# EAGLE design MainBoard (EAGLE 9.6.2)
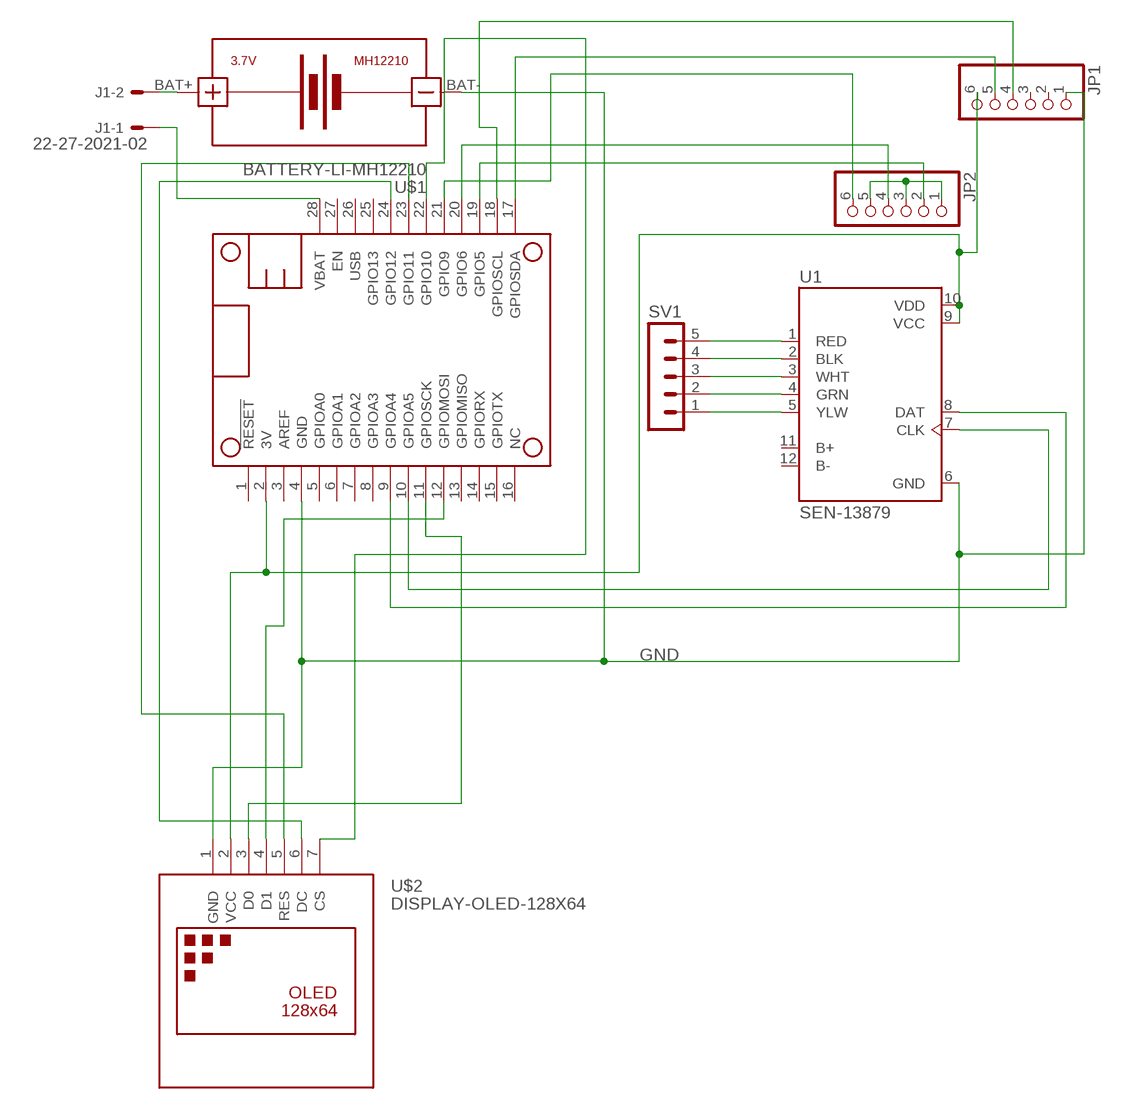
[diagram p0: schematic, sheet 1]

## Parts
J1  22-27-2021-02  [6410-02]
JP1  PINHD-1X6  [1X06]
JP2  PINHD-1X6  [1X06]
MS1  FEATHERWING_NODIM  [FEATHERWING_DIM]
SV1  MA05-1  [MA05-1]
U1  SEN-13879  [SPARKFUN_SEN-13879]
U$1  BATTERY-LI-MH12210  [BATTERY-LI-MH12210]
U$2  DISPLAY-OLED-128X64  [DISPLAY-OLED-128X64]

## Nets
3V: JP1.6 MS1.2(3V) U1.9(VCC) U1.10(VDD) U$2.2(VCC)
GND: JP1.1 MS1.4(GND) U1.6(GND) U$1.BAT- U$2.1(GND)
N$1: JP2.2 MS1.19(GPIO5)
N$2: MS1.9(GPIOA4) U1.8(DAT)
N$3: MS1.10(GPIOA5) U1.7(CLK)
N$4: J1.2 U$1.BAT+
N$5: SV1.1 U1.5(YLW)
N$6: SV1.2 U1.4(GRN)
N$7: SV1.3 U1.3(WHT)
N$8: JP2.4 MS1.20(GPIO6)
N$9: JP2.6 MS1.21(GPIO9)
N$10: MS1.22(GPIO10) U$2.7(CS)
N$11: MS1.11(GPIOSCK) U$2.3(D0)
N$12: MS1.12(GPIOMOSI) U$2.4(D1)
N$13: MS1.23(GPIO11) U$2.5(RES)
N$14: MS1.24(GPIO12) U$2.6(DC)
N$15: SV1.4 U1.2(BLK)
N$16: SV1.5 U1.1(RED)
N$21: JP1.4 MS1.18(GPIOSCL)
N$23: JP2.1 JP2.3 JP2.5
SDA: JP1.5 MS1.17(GPIOSDA)
VBAT: J1.1 MS1.28(VBAT)
Unconnected: JP1.2 JP1.3 MS1.1(!RESET) MS1.3(AREF) MS1.5(GPIOA0) MS1.6(GPIOA1) MS1.7(GPIOA2) MS1.8(GPIOA3) MS1.13(GPIOMISO) MS1.14(GPIORX) MS1.15(GPIOTX) MS1.16(NC) MS1.25(GPIO13) MS1.26(USB) MS1.27(EN) U1.11(B+) U1.12(B-)

## Library data of the parts
J1 = con-molex:22-?-02: CONNECTOR wire to board 2.54 mm (.1 inch) pitch header; MF: MOLEX; OC_FARNELL: unknown; OC_NEWARK: unknown
JP1 JP2 = adafruit:PINHD-1X6: PIN HEADER
MS1 = adafruit:FEATHERWING
SV1 = con-lstb:MA05-1: PIN HEADER; OC_FARNELL: unknown; OC_NEWARK: unknown
U1 = SEN-13879:SEN-13879: Load Cell Amp Hx711; AVAILABILITY: Unavailable; DESCRIPTION: External Input Sensor Amplifier; MF: SparkFun; MP: SEN-13879; PACKAGE: None; PRICE: None
U$1 = diy-modules:BATTERY-LI-MH12210: Lithium-Ion MH12210 Rechargeable Battery Panasonic NCR18650PF battery datasheet available here: https://industrial.panasonic.com/cdbs/www-data/pdf2/ACI4000/ACI4000C12.pdf Click here to find device on ebay.com <http://www.ebay.com/sch/ncr18650b+battery>
U$2 = diy-modules:DISPLAY-OLED-128X64: 128x64 Dot Matrix OLED Module based on SSD1306 chip Variant with SPI interface More details available here: http://www.instructables.com/id/How-to-use-OLED-display-arduino-module/ SSD1306 datasheet: https://cdn-shop.adafruit.com/datasheets/SSD1306.pdf Click here to find device on ebay.com <http://www.ebay.com/sch/oled+display+128x64> Note: There are two variants: I2C and SPI. Search for the proper version.

## Board
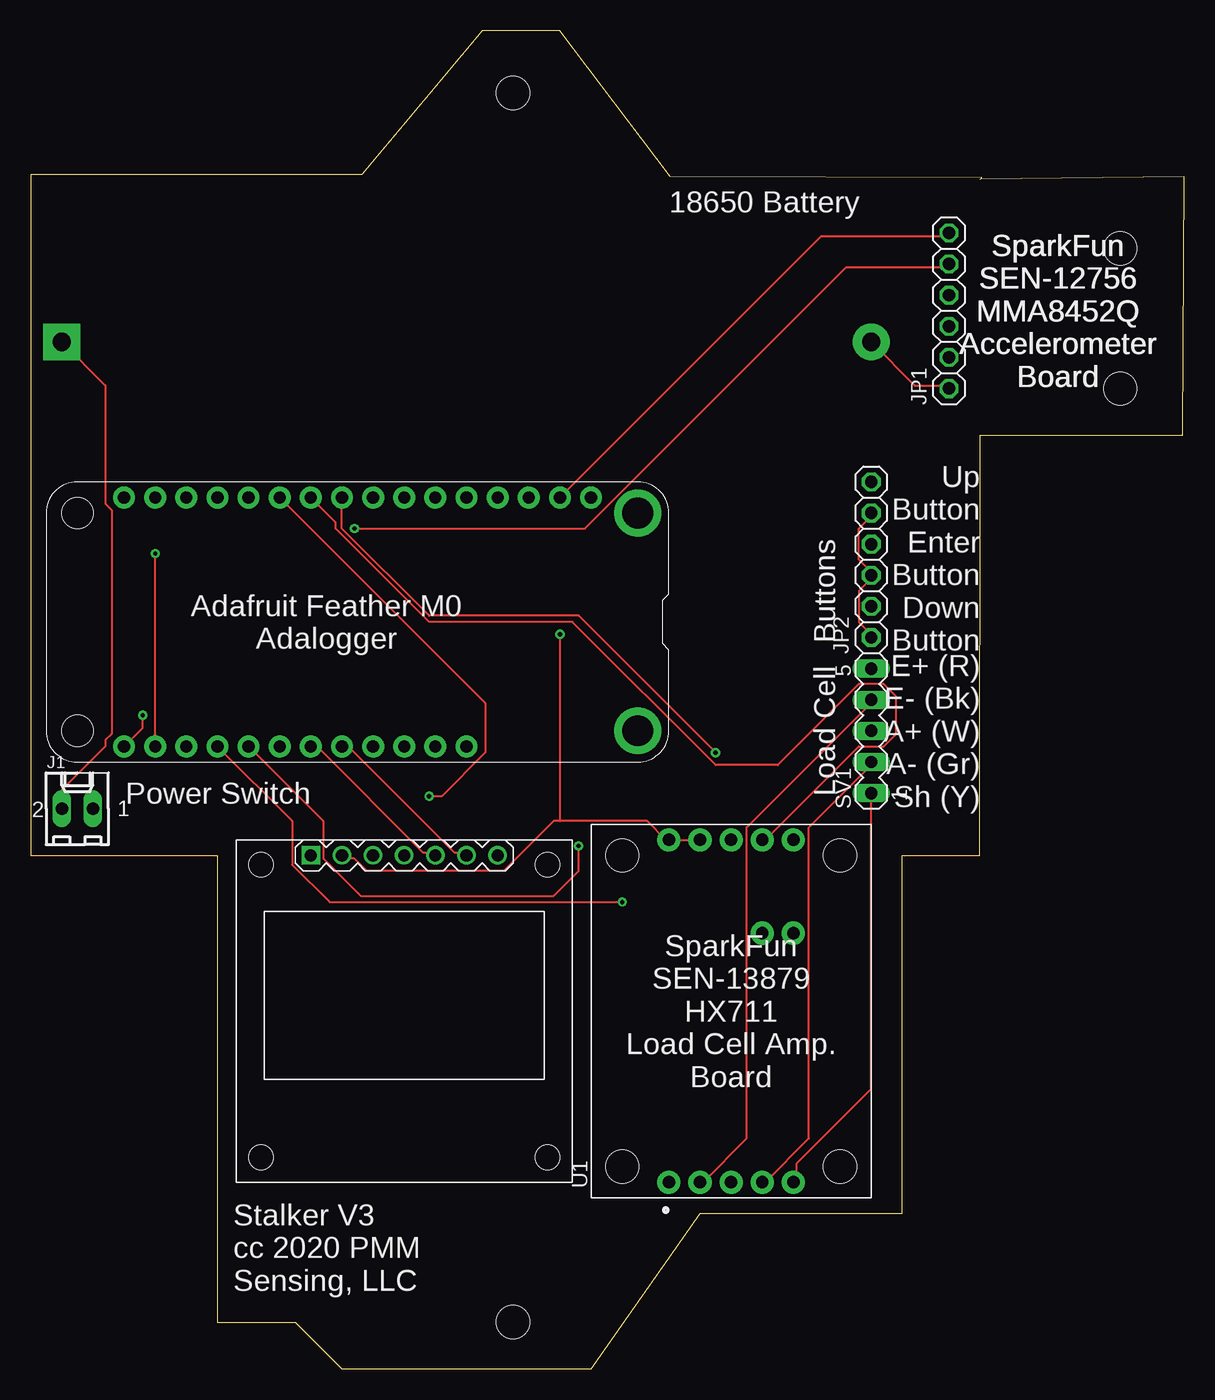
[diagram p1: board, top side]
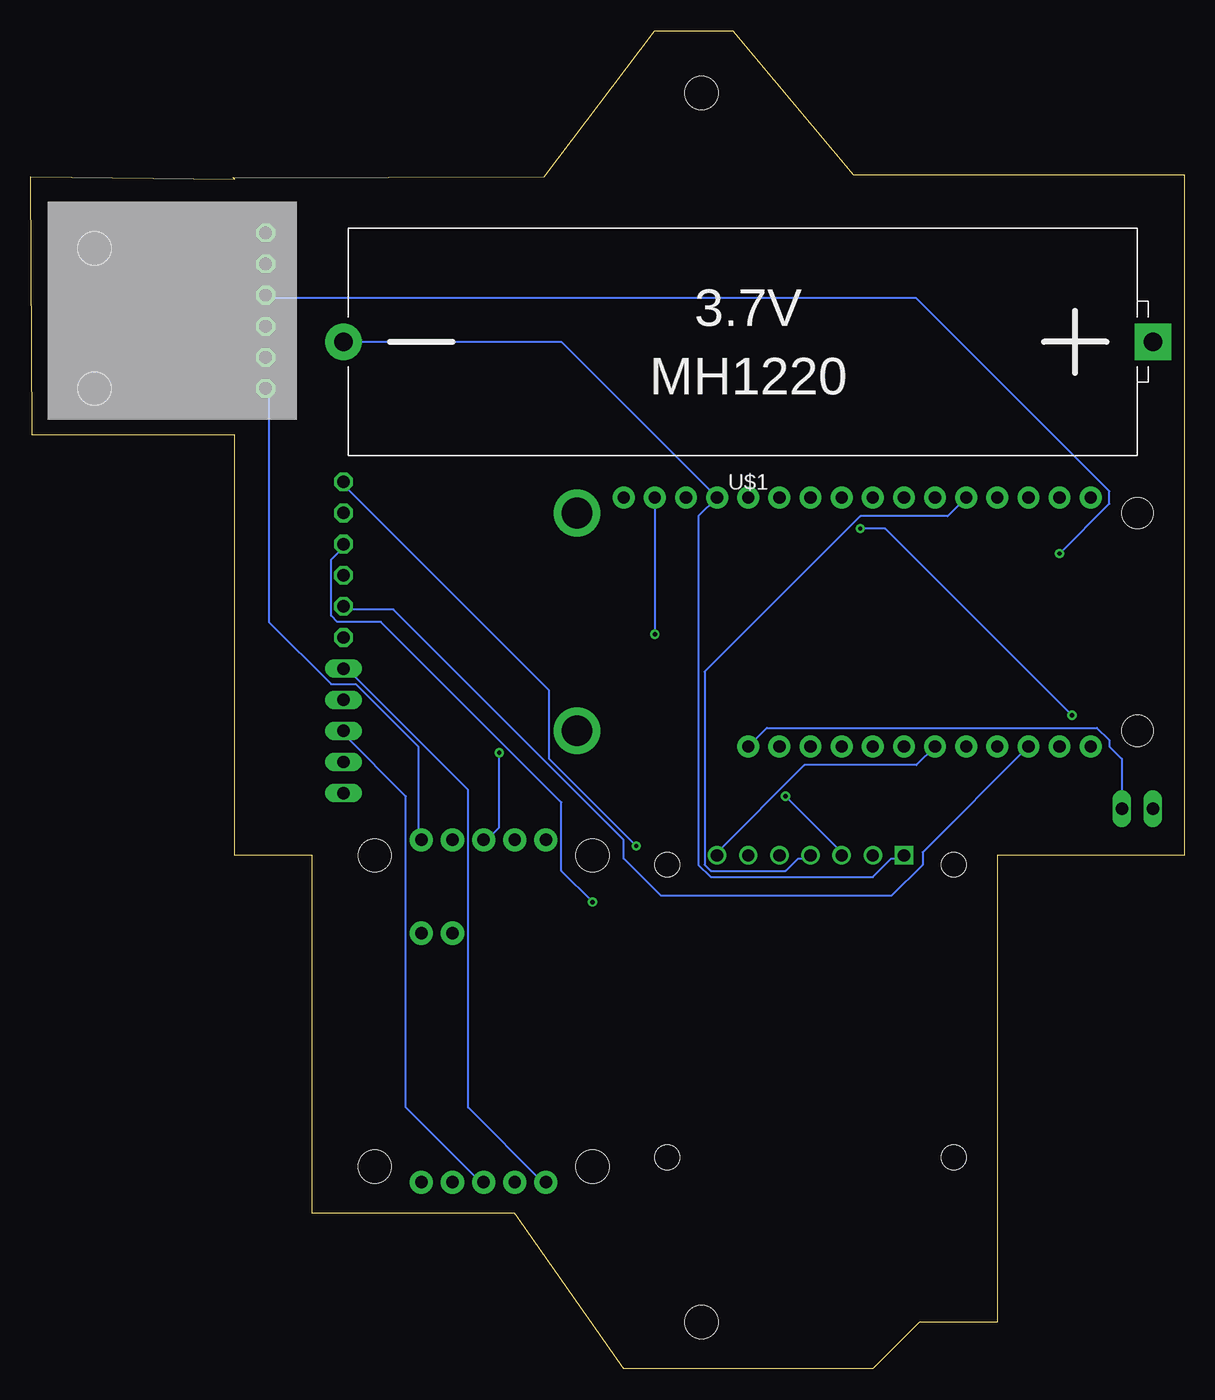
[diagram p2: board, bottom side, seen from below]

Size 94.11 x 109.22 mm. Coordinates in mm from the lower left corner, seen from the top.
Outline: 0,41.91 15.24,41.91 15.24,3.81 21.59,3.81 25.4,0 45.72,0 54.61,12.7 71.12,12.7 71.12,41.91 77.45,41.91 77.47,76.2 93.98,76.2 94.11,97.28 77.47,97.1 77.58,97.21 52.2,97.28 43.18,109.22 36.83,109.22 27,97.46 0,97.46 0,41.91
Copper layers (1*16): Top 0.035mm / dielectric 0.15mm / Bottom 0.035mm
Design rules "default": minimum track width 6mil, minimum drill 0.35mm, track to track 6mil, track to pad 6mil, pad to pad 6mil, via to via 6mil, smd to smd 6mil, copper to edge 40mil, drill to drill 6mil, minimum pad ring 10mil, minimum via ring 8mil, stop-mask expansion 4mil, vias tented up to drill 0mil, thermal gap 10mil
Holes 2.71 mm at 39.37,104.14 39.37,3.81
Holes 2.69 mm at 48.26,41.91 48.26,16.51 66.04,16.51 66.04,41.91 88.9,91.44 88.9,80.01

### Footprints (pad centres in the part's own frame; a part is rotated, then mirrored left to right if it is on the bottom)
6410-02 = drill 1.016 long: 1 1.27,0; 2 -1.27,0
1X06 = drill 1.016 octagon: 1 -6.35,0; 2 -3.81,0; 3 -1.27,0; 4 1.27,0; 5 3.81,0; 6 6.35,0
FEATHERWING_DIM = drill 1 pad 1.778: 1 6.35,1.27; 2 8.89,1.27; 3 11.43,1.27; 4 13.97,1.27; 5 16.51,1.27; 6 19.05,1.27; 7 21.59,1.27; 8 24.13,1.27; 9 26.67,1.27; 10 29.21,1.27; 11 31.75,1.27; 12 34.29,1.27; 13 36.83,1.27; 14 39.37,1.27; 15 41.91,1.27; 16 44.45,1.27; 17 44.45,21.59; 18 41.91,21.59; 19 39.37,21.59; 20 36.83,21.59; 21 34.29,21.59; 22 31.75,21.59; 23 29.21,21.59; 24 26.67,21.59; 25 24.13,21.59; 26 21.59,21.59; 27 19.05,21.59; 28 16.51,21.59 | drill 2.5 pad 3.81: P$1 2.54,20.32; P$2 2.54,2.54 | hole 2.54: 48.26,20.32; 48.26,2.54
MA05-1 = drill 1.016 long: 1 -5.08,0; 2 -2.54,0; 3 0,0; 4 2.54,0; 5 5.08,0
SPARKFUN_SEN-13879 = drill 1.016 pad 1.88: 1 -13.97,5.08; 2 -13.97,2.54; 3 -13.97,0; 4 -13.97,-2.54; 5 -13.97,-5.08; 6 13.97,-5.08; 7 13.97,-2.54; 8 13.97,0; 9 13.97,2.54; 10 13.97,5.08; 11 6.35,-2.54; 12 6.35,-5.08
BATTERY-LI-MH12210 = drill 1.5 pad 3 square: BAT+ -33.02,0 | drill 1.5 pad 3: BAT- 33.02,0
DISPLAY-OLED-128X64 = drill 1 square: 1 -7.62,12.7 | drill 1: 2 -5.08,12.7; 3 -2.54,12.7; 4 0,12.7; 5 2.54,12.7; 6 5.08,12.7; 7 7.62,12.7 | hole 2: -11.684,11.938; 11.684,11.938; 11.684,-11.938; -11.684,-11.938

### Placement (x,y rotation side)
J1  3.81,45.72 0 top
JP1  74.93,86.36 90 top
JP2  68.58,66.04 90 top
MS1  52.07,72.39 180 top
SV1  68.58,52.07 90 top
U1  57.15,29.21 90 top
U$1  35.56,83.82 180 bottom
U$2  30.48,29.21 0 top

### Tracks (layer width: path | path; a pad name or v marks a point on that pad's centre or on a via)
3V  (via drill 0.35)
  Top 0.152: 43.18,44.7 50.29,44.7 51.82,43.18 U1.10 U1.9 | 43.18,44.7 42.67,44.7 38.61,40.64 27.43,40.64 26.42,41.66 25.4,41.66 U$2.2 | MS1.2 64.52,92.46 74.68,92.46 JP1.6 | v43.18,59.94 43.18,44.7
  Bottom 0.152: MS1.2 v43.18,59.94
GND
  Top 0.152: U$1.BAT- 72.14,80.26 74.68,80.26 JP1.1
  Bottom 0.152: U$2.1 22.86,41.66 23.88,41.66 25.4,40.13 38.61,40.13 39.62,41.15 39.62,69.6 MS1.4 50.8,83.82 U$1.BAT- | U1.6 62.48,43.18 62.48,50.8 67.56,55.88 69.6,55.88 74.68,60.96 74.68,79.76 JP1.1
N$1
  Bottom 0.152: MS1.19 21.34,42.16 21.34,41.15 23.88,38.61 42.67,38.61 45.72,41.66 45.72,43.18 64.52,61.98 68.58,61.98 JP2.2
N$2  (via drill 0.35)
  Top 0.152: MS1.9 25.4,68.58 32.51,61.47 44.7,61.47 v55.88,50.29
  Bottom 0.152: v55.88,50.29 55.88,44.2 56.9,43.18 U1.8
N$3
  Top 0.152: MS1.10 24.89,69.09 24.89,68.58 32.51,60.96 44.2,60.96 55.88,49.28 60.96,49.28 67.56,55.88 69.6,55.88 70.61,54.86 70.61,51.82 69.6,50.8 67.56,50.8 59.94,43.18 U1.7
N$4
  Top 0.152: J1.2 2.54,47.24 6.1,50.8 6.1,51.31 6.6,51.82 6.6,70.1 6.1,70.61 6.1,80.26 U$1.BAT+
N$5
  Top 0.152: SV1.1 68.58,22.86 62.48,16.76 62.48,15.24 U1.5
N$6
  Top 0.152: SV1.2 68.58,49.28 63.5,44.2 63.5,18.8 59.94,15.24 U1.4
N$7
  Bottom 0.152: SV1.3 68.58,51.82 63.5,46.74 63.5,21.34 57.4,15.24 U1.3
N$8  (via drill 0.35)
  Top 0.152: v48.26,38.1 24.38,38.1 21.34,41.15 21.34,44.7 MS1.20
  Bottom 0.152: v48.26,38.1 50.8,40.64 50.8,46.23 65.53,60.96 69.09,60.96 69.6,61.47 69.6,66.04 68.58,67.06 JP2.4
N$9  (via drill 0.35)
  Top 0.152: v44.7,42.67 44.7,40.64 42.67,38.61 26.92,38.61 23.88,41.66 23.88,44.7 MS1.21
  Bottom 0.152: v44.7,42.67 51.82,49.78 51.82,55.37 68.58,72.14 JP2.6
N$10
  Bottom 0.152: MS1.22 21.84,49.28 30.99,49.28 38.1,42.16 U$2.7
N$11  (via drill 0.35)
  Top 0.152: v32.51,46.74 33.53,46.74 37.08,50.29 37.08,54.36 MS1.11
  Bottom 0.152: v32.51,46.74 27.94,42.16 U$2.3
N$12
  Bottom 0.152: MS1.12 19.3,69.6 26.42,69.6 39.12,56.9 39.12,41.15 38.61,40.64 32.51,40.64 31.5,41.66 30.48,41.66 U$2.4
N$13
  Top 0.152: MS1.23 23.37,50.8 32,42.16 33.02,42.16 U$2.5
N$14
  Top 0.152: MS1.24 25.91,50.8 34.54,42.16 35.56,42.16 U$2.6
N$15
  Top 0.152: SV1.4 68.58,54.36 58.42,44.2 58.42,18.8 54.86,15.24 U1.2
N$16
  Bottom 0.152: SV1.5 68.58,56.9 68.07,56.9 58.42,47.24 58.42,21.34 52.32,15.24 U1.1
N$21  (via drill 0.35)
  Top 0.152: MS1.18 v10.16,66.55
  Bottom 0.152: v10.16,66.55 6.1,70.61 6.1,71.63 21.84,87.38 74.68,87.38 JP1.4
N$23
  Top 0.152: JP2.1 68.58,59.94 67.56,60.96 67.56,63.5 68.58,64.52 JP2.3 68.58,65.02 67.56,66.04 67.56,68.58 68.58,69.6 JP2.5
SDA  (via drill 0.35)
  Top 0.152: v26.42,68.58 45.21,68.58 66.55,89.92 74.68,89.92 JP1.5 | v9.14,53.34 9.14,52.32 MS1.17
  Bottom 0.152: v26.42,68.58 24.38,68.58 v9.14,53.34
VBAT
  Bottom 0.152: J1.1 5.08,49.78 6.1,50.8 6.1,51.31 7.11,52.32 34.04,52.32 MS1.28

### Text on the board
tNames: 18650 Battery | SparkFun / SEN-12756 / MMA8452Q / Accelerometer / Board | SparkFun / SEN-12756 / MMA8452Q / Accelerometer / Board | SparkFun / SEN-12756 / MMA8452Q / Accelerometer / Board | SparkFun / SEN-12756 / MMA8452Q / Accelerometer / Board | Up / Button / Enter / Button / Down / Button | Buttons | Adafruit Feather M0 / Adalogger | Load Cell | E+ (R) / E- (Bk) / A+ (W) / A- (Gr) / Sh (Y) | Power Switch | SparkFun / SEN-13879 / HX711 / Load Cell Amp. / Board | Stalker V3 / cc 2020 PMM / Sensing, LLC